# Altium project neuro_module.PrjPcb
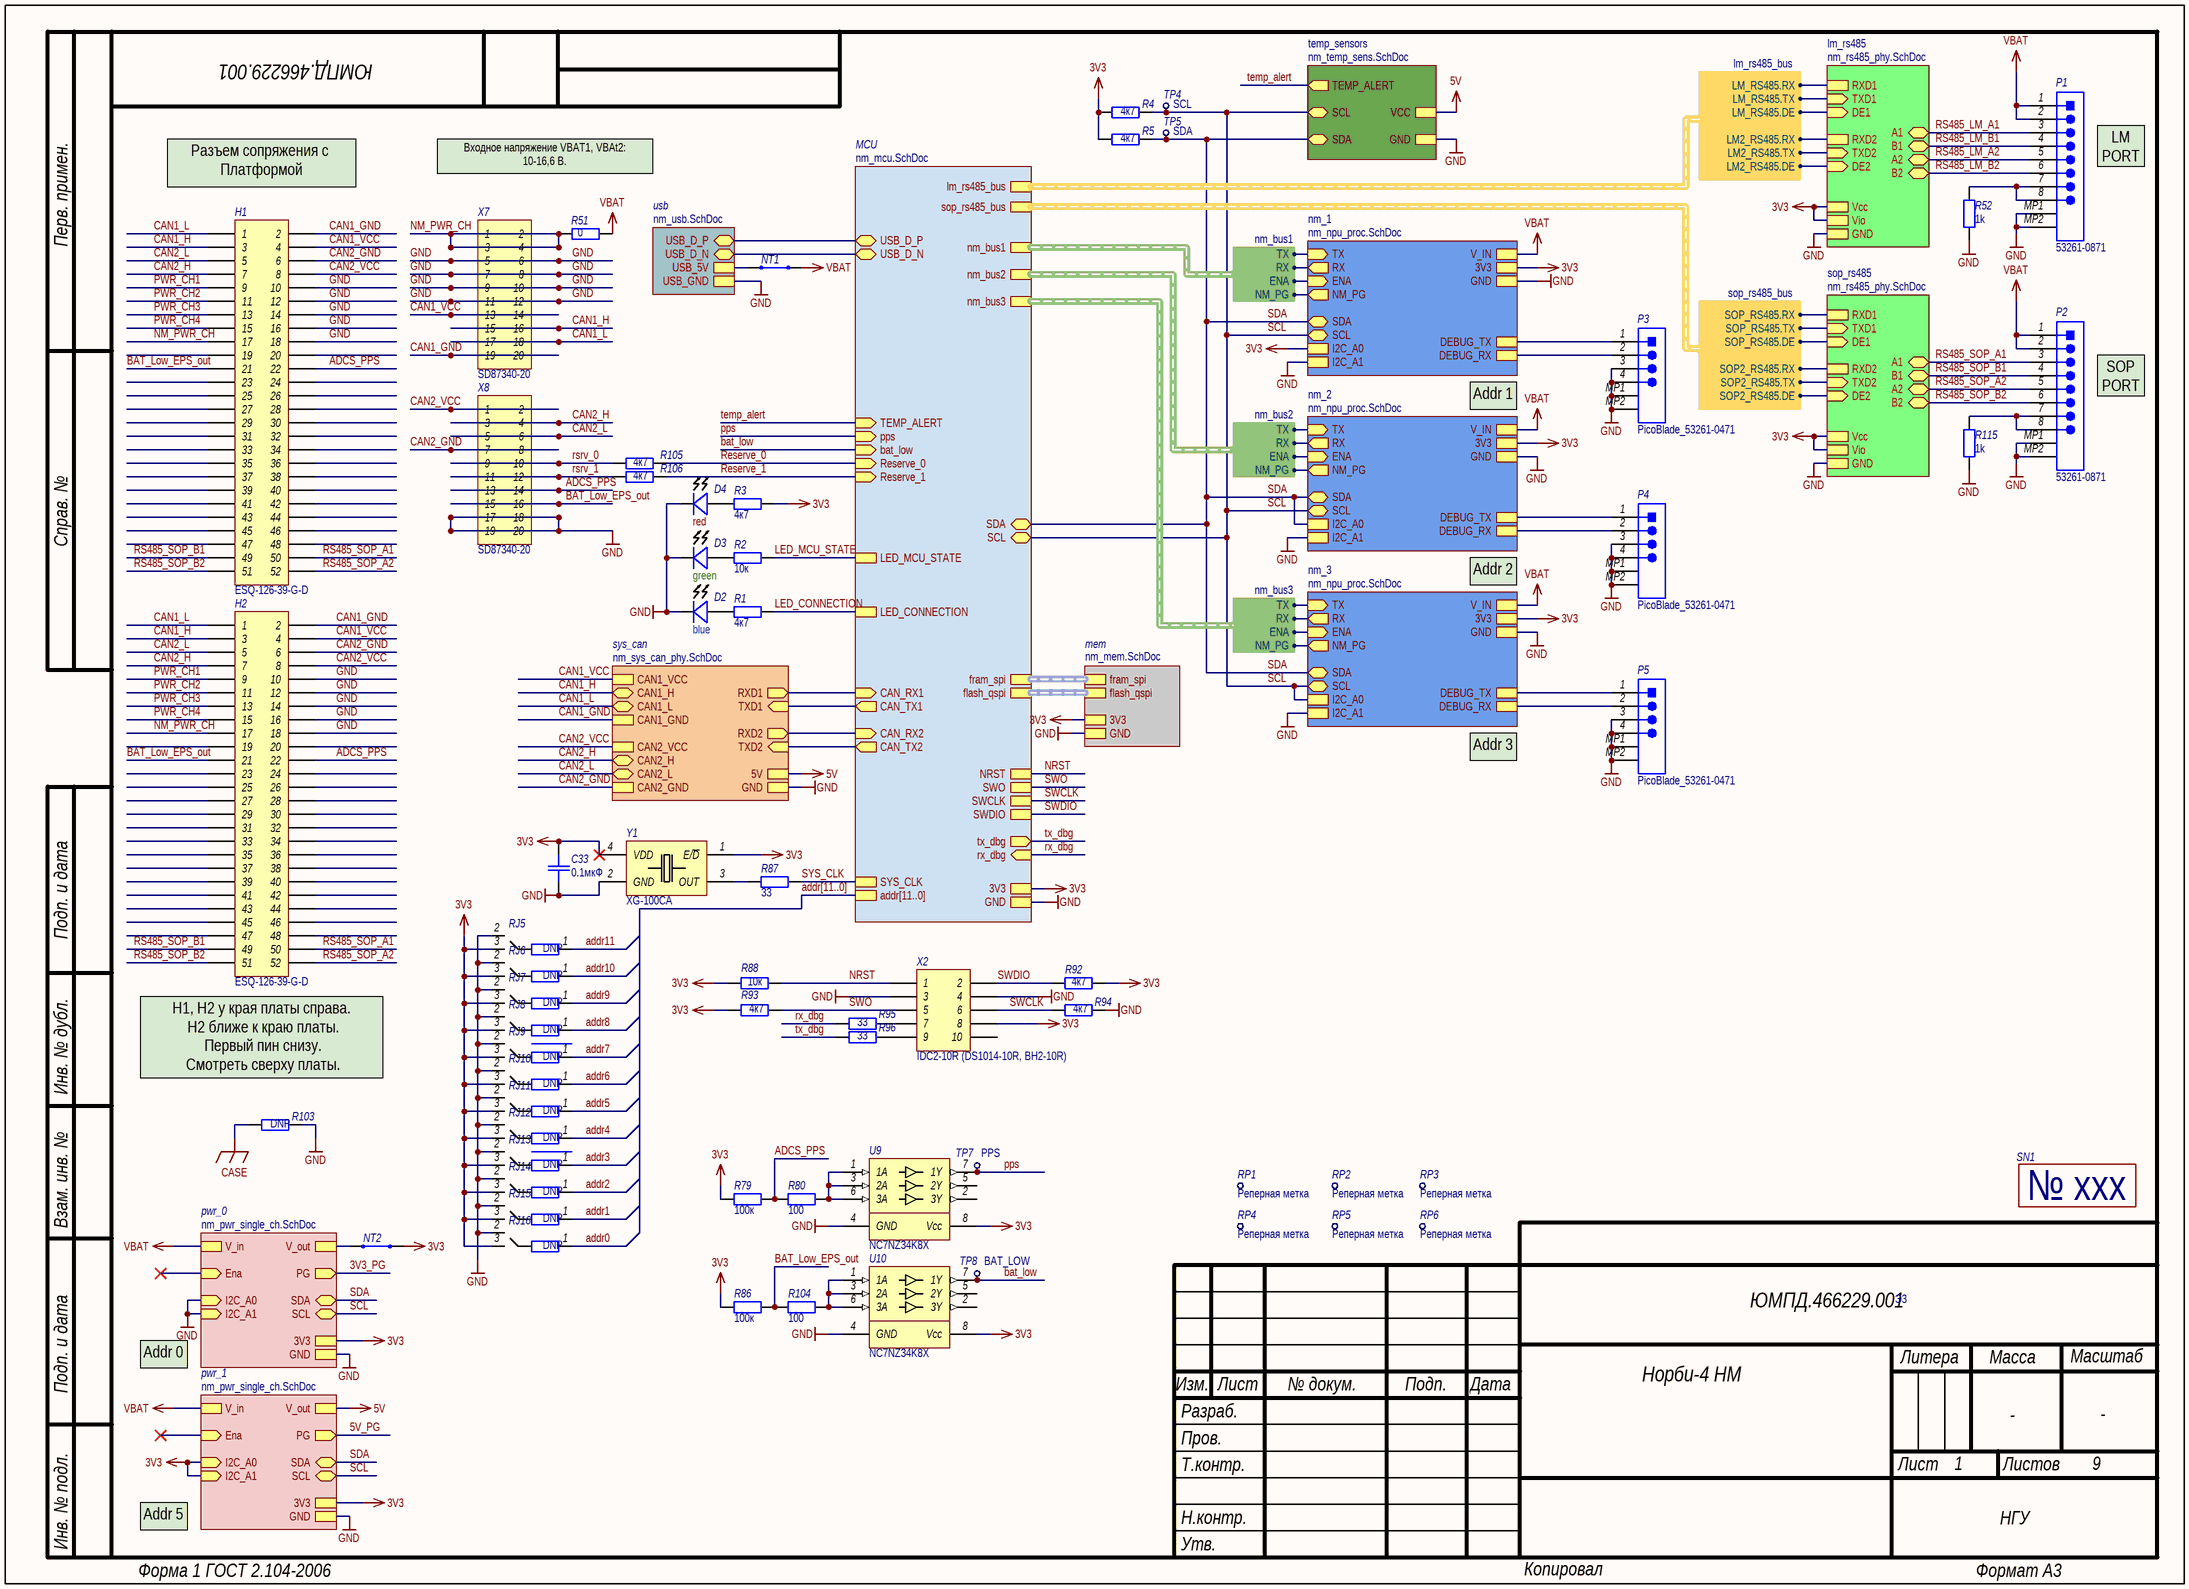
[diagram p0: nm_main.SchDoc]
GlobalOrganizationName: НГУ; GlobalProjectName1: Норби-4 НМ; GlobalProjectNumber: ЮМПД.466229.001; GlobalProjectRevision: v1.0
5 sheets, 141 parts. Net scope: hierarchical (ports join the sheet entries above them; power ports are global).
Board file: neuro_module.PcbDoc
Sheets:
  nm_main.SchDoc
    MCU = nm_mcu.SchDoc
    mem = nm_mem.SchDoc
    nm_3 = nm_npu_proc.SchDoc
    nm_2 = nm_npu_proc.SchDoc
    nm_1 = nm_npu_proc.SchDoc
    temp_sensors = nm_temp_sens.SchDoc

## Sheet nm_main.SchDoc: =GlobalProjectName
size 410 x 297 mm; Organization: НГУ; DocumentNumber: ЮМПД.466229.001 Э3; Revision: v1.0; SheetNumber: 1; SheetTotal: 9; PageSetup: Record=PageOptions|CenterHorizontal=True|CenterVertical=True|PrintScale=1.00|XCorrection=1.00|YCorrection=1.00|PrintKind=1|BorderSize=5000000|LeftOffset=0|BottomOffset=0|Orientation=2|PaperLength=1000|PaperWidth=1000|Scale=100|PaperSource=15|PrintQuality=1200|MediaType=1|DitherType=10|PaperKind=A3|PrintScaleMode=1; Weight: -; ScaleFactor: -; FirstApplication: ЮМПД.466229.001

### Parts
C33  0.1мкФ  [SMD_C0603]
D2  value blue  [LED_0603]  (hidden comment: LED)
D3  value green  [LED_0603]  (hidden comment: LED)
D4  value red  [LED_0603]  (hidden comment: LED)
H1  ESQ-126-39-G-D  [ESQ-126-39-G-D]
H2  ESQ-126-39-G-D  [ESQ-126-39-G-D]
NT1  OSM R1-8  [NetTie_1mm]  (value not drawn)  (net tie, no BOM)
NT2  OSM R1-8  [NetTie_1mm]  (value not drawn)  (net tie, no BOM)
P1  53261-0871  [53261-0871]
P2  53261-0871  [53261-0871]
P3  PicoBlade_53261-0471  [53261-0471]
P4  PicoBlade_53261-0471  [53261-0471]
P5  PicoBlade_53261-0471  [53261-0471]
R1  4к7  [SMD_0603]
R2  10к  [SMD_0603]
R3  4к7  [SMD_0603]
R4  4к7  [SMD_0603]
R5  4к7  [SMD_0603]
R51  0  [SMD_1206]
R52  1k  [SMD_0603]
R79  100к  [SMD_0603]
R80  100  [SMD_0603]
R86  100к  [SMD_0603]
R87  33  [SMD_0603]
R88  value 10к  [SMD_0603]  (hidden comment: Resistor)
R92  4к7  [SMD_0603]
R93  4к7  [SMD_0603]
R94  4к7  [SMD_0603]
R95  33  [SMD_0603]
R96  33  [SMD_0603]
R103  DNP  [SMD_0805]
R104  100  [SMD_0603]
R105  4к7  [SMD_0603]
R106  4к7  [SMD_0603]
R115  1k  [SMD_0603]
RJ5  value DNP  [SMD_JMP_0402]  (hidden comment: OSM R1-8)
RJ6  value DNP  [SMD_JMP_0402]  (hidden comment: OSM R1-8)
RJ7  value DNP  [SMD_JMP_0402]  (hidden comment: OSM R1-8)
RJ8  value DNP  [SMD_JMP_0402]  (hidden comment: OSM R1-8)
RJ9  value DNP  [SMD_JMP_0402]  (hidden comment: OSM R1-8)
RJ10  value DNP  [SMD_JMP_0402]  (hidden comment: OSM R1-8)
RJ11  value DNP  [SMD_JMP_0402]  (hidden comment: OSM R1-8)
RJ12  value DNP  [SMD_JMP_0402]  (hidden comment: OSM R1-8)
RJ13  value DNP  [SMD_JMP_0402]  (hidden comment: OSM R1-8)
RJ14  value DNP  [SMD_JMP_0402]  (hidden comment: OSM R1-8)
RJ15  value DNP  [SMD_JMP_0402]  (hidden comment: OSM R1-8)
RJ16  value DNP  [SMD_JMP_0402]  (hidden comment: OSM R1-8)
RP1  Наименование: Реперная метка  [ReperPoint]  (hidden comment: RP)  (no BOM)
RP2  Наименование: Реперная метка  [ReperPoint]  (hidden comment: RP)  (no BOM)
RP3  Наименование: Реперная метка  [ReperPoint]  (hidden comment: RP)  (no BOM)
RP4  Наименование: Реперная метка  [ReperPoint]  (hidden comment: RP)  (no BOM)
RP5  Наименование: Реперная метка  [ReperPoint]  (hidden comment: RP)  (no BOM)
RP6  Наименование: Реперная метка  [ReperPoint]  (hidden comment: RP)  (no BOM)
SN1  Место под нанесение серийного номера  [Serial_number_v2]  (value not drawn)  (graphical)
TP4  SCL  [TP_PAD_1]  (no BOM)
TP5  SDA  [TP_PAD_1]  (no BOM)
TP7  PPS  [TP_PAD_1]  (no BOM)
TP8  BAT_LOW  [TP_PAD_1]  (no BOM)
U9  Наименование: NC7NZ34K8X  [US-8]  (hidden comment: NC7NZ34)
U10  Наименование: NC7NZ34K8X  [US-8]  (hidden comment: NC7NZ34)
X2  Наименование: IDC2-10R (DS1014-10R, BH2-10R)  [IDC2-10R]  (hidden comment: Header 2X10)
X7  Наименование: SD87340-20  [PLD2-20_SD87340-20]  (hidden comment: Header 2X20)
X8  Наименование: SD87340-20  [PLD2-20_SD87340-20]  (hidden comment: Header 2X20)
Y1  Наименование: XG-100CA  [SMD_7050_Crystal_Oscillator]  (hidden comment: XG-1000CA)

### Sub-sheets
lm_rs485 = nm_rs485_phy.SchDoc (file not in this document): A1 (bidir), RXD1, TXD1 (in), DE1 (in), B1 (bidir), A2 (bidir), RXD2, TXD2 (in), DE2 (in), B2 (bidir), Vcc, Vio, GND
MCU = nm_mcu.SchDoc: SDA (bidir), SCL (bidir), USB_D_P (bidir), USB_D_N (bidir), LED_MCU_STATE, LED_CONNECTION, bat_low (in), CAN_TX2 (out), CAN_RX2 (in), CAN_TX1 (out), CAN_RX1 (in), SYS_CLK, NRST, tx_dbg (out), SWO, rx_dbg (in), SWCLK, GND, SWDIO, 3V3, fram_spi, flash_qspi, Reserve_0 (in), Reserve_1 (in), addr[11..0], nm_bus1 (harness nm_bus1), nm_bus2 (harness nm_bus2), nm_bus3 (harness nm_bus3), lm_rs485_bus (harness lm_rs485_bus), sop_rs485_bus (harness sop_rs485_bus), pps (in), TEMP_ALERT (in)
mem = nm_mem.SchDoc: 3V3, GND, fram_spi (harness fram_spi), flash_qspi (harness flash_qspi)
nm_1 = nm_npu_proc.SchDoc: GND, V_IN, TX (in), RX (out), 3V3, ENA (in), I2C_A0, I2C_A1, SCL (bidir), SDA (bidir), NM_PG (out), DEBUG_TX, DEBUG_RX
nm_2 = nm_npu_proc.SchDoc: GND, V_IN, TX (in), RX (out), 3V3, ENA (in), I2C_A0, I2C_A1, SCL (bidir), SDA (bidir), NM_PG (out), DEBUG_TX, DEBUG_RX
nm_3 = nm_npu_proc.SchDoc: GND, V_IN, TX (in), RX (out), DEBUG_TX, DEBUG_RX, 3V3, ENA (in), I2C_A0, I2C_A1, SCL (bidir), SDA (bidir), NM_PG (out)
pwr_0 = nm_pwr_single_ch.SchDoc (file not in this document): Ena (in), V_in, PG (out), GND, V_out, SCL (bidir), SDA (bidir), I2C_A0 (in), I2C_A1 (in), 3V3  | TP_STR: 3V3; R1_Value: 150к; R2_Value: 47к; R_efuse1_mid: 120к; R_efuse1_bot: 43к; R_efuse1_ilim: 3к3; R_pwr_led: 4к7; R_efuse2_bot: 270к; R_efuse1_top: 470к; R_efuse2_mid: 91к; R_efuse2_ilim: 1к1; R_efuse2_top: 470к; C_efuse2_dVdT: 10нФ; C_efuse2_itimer: 2.4нФ
pwr_1 = nm_pwr_single_ch.SchDoc (file not in this document): Ena (in), V_in, PG (out), GND, V_out, SCL (bidir), SDA (bidir), I2C_A0 (in), I2C_A1 (in), 3V3  | TP_STR: 5V0; R1_Value: 160к; R2_Value: 30к; R_efuse1_mid: 120к; R_efuse1_bot: 43к; R_efuse1_ilim: 3к3; R_pwr_led: 4к7; R_efuse2_bot: 130к; R_efuse2_mid: 62к; R_efuse2_ilim: 3к3; R_efuse1_top: 470к; R_efuse2_top: 470к; C_efuse2_dVdT: 10нФ; C_efuse2_itimer: 2.4нФ
sop_rs485 = nm_rs485_phy.SchDoc (file not in this document): A1 (bidir), RXD1, TXD1 (in), DE1 (in), B1 (bidir), A2 (bidir), RXD2, TXD2 (in), DE2 (in), B2 (bidir), Vcc, Vio, GND
sys_can = nm_sys_can_phy.SchDoc (file not in this document): CAN1_GND, CAN2_H (bidir), CAN2_L (bidir), TXD2 (in), CAN2_GND, CAN1_H (bidir), RXD2 (out), TXD1 (in), CAN2_VCC, CAN1_L (bidir), RXD1 (out), CAN1_VCC, 5V, GND
temp_sensors = nm_temp_sens.SchDoc: VCC, GND, SDA (bidir), SCL (bidir), TEMP_ALERT (out)
usb = nm_usb.SchDoc (file not in this document): USB_D_P (bidir), USB_D_N (bidir), USB_5V, USB_GND

### Harnesses
nm_bus1: TX, RX, ENA, NM_PG
nm_bus2: TX, RX, ENA, NM_PG
nm_bus3: TX, RX, ENA, NM_PG
lm_rs485_bus: LM_RS485.RX, LM_RS485.TX, LM_RS485.DE, LM2_RS485.RX, LM2_RS485.TX, LM2_RS485.DE
sop_rs485_bus: SOP_RS485.RX, SOP_RS485.TX, SOP_RS485.DE, SOP2_RS485.RX, SOP2_RS485.TX, SOP2_RS485.DE

### Nets
3V3: C33.2 NT2.2 R3.1 R4.2 R5.2 R79.1 R86.1 R88.1 R92.2 R93.2 RJ5.3 RJ6.3 RJ7.3 RJ8.3 RJ9.3 RJ10.3 RJ11.3 RJ12.3 RJ13.3 RJ14.3 RJ15.3 RJ16.3 U9.8(Vcc) U10.8(Vcc) X2.8 Y1.1(E/~{D}) Y1.4(VDD) ; sheet MCU/3V3, sheet pwr_0/3V3, sheet mem/3V3, sheet pwr_1/I2C_A0, sheet pwr_1/I2C_A1, sheet pwr_1/3V3, sheet nm_3/3V3, sheet lm_rs485/Vcc, sheet lm_rs485/Vio, sheet nm_2/3V3, sheet nm_1/3V3, sheet nm_1/I2C_A0, sheet sop_rs485/Vcc, sheet sop_rs485/Vio
5V: sheet sys_can/5V, sheet pwr_1/V_out, sheet temp_sensors/VCC
CASE: R103.2
GND: C33.1 D2.2(K) D3.2(K) D4.2(K) H1.10 H1.12 H1.14 H1.16 H1.18 H2.10 H2.12 H2.14 H2.16 H2.18 P1.MP1 P1.MP2 P2.MP1 P2.MP2 P3.3 P3.4 P3.MP1 P3.MP2 P4.3 P4.4 P4.MP1 P4.MP2 P5.3 P5.4 P5.MP1 P5.MP2 R52.1 R94.1 R103.1 R115.1 RJ5.2 RJ6.2 RJ7.2 RJ8.2 RJ9.2 RJ10.2 RJ11.2 RJ12.2 RJ13.2 RJ14.2 RJ15.2 RJ16.2 U9.4(GND) U10.4(GND) X2.3 X2.4 X7.5 X7.6 X7.7 X7.8 X7.9 X7.10 X7.11 X7.12 X8.17 X8.18 X8.19 X8.20 Y1.2(GND) ; sheet MCU/GND, sheet usb/USB_GND, sheet pwr_0/GND, sheet pwr_0/I2C_A0, sheet pwr_0/I2C_A1, sheet mem/GND, sheet sys_can/GND, sheet pwr_1/GND, sheet nm_3/GND, sheet nm_3/I2C_A1, sheet lm_rs485/GND, sheet nm_2/GND, sheet nm_2/I2C_A1, sheet nm_1/GND, sheet nm_1/I2C_A1, sheet sop_rs485/GND, sheet temp_sensors/GND
VBAT: NT1.2 P1.1 P1.2 P2.1 P2.2 R51.2 ; sheet pwr_0/V_in, sheet pwr_1/V_in, sheet nm_3/V_IN, sheet nm_2/V_IN, sheet nm_1/V_IN
3V3_PG: sheet pwr_0/PG
5V_PG: sheet pwr_1/PG
ADCS_PPS: H1.22 H2.22 R79.2 R80.1 X8.13 X8.14
addr0: RJ16.1
addr1: RJ15.1
addr2: RJ14.1
addr3: RJ13.1
addr4: RJ12.1
addr5: RJ11.1
addr6: RJ10.1
addr7: RJ9.1
addr8: RJ8.1
addr9: RJ7.1
addr10: RJ6.1
addr11: RJ5.1
bat_low: TP8.0(TP) U10.7(1Y) ; sheet MCU/bat_low
BAT_Low_EPS_out: H1.21 H2.21 R86.2 R104.1 X8.15 X8.16
CAN1_GND: H1.2 H2.2 X7.19 X7.20 ; sheet sys_can/CAN1_GND
CAN1_H: H1.3 H2.3 X7.15 X7.16 ; sheet sys_can/CAN1_H
CAN1_L: H1.1 H2.1 X7.17 X7.18 ; sheet sys_can/CAN1_L
CAN1_VCC: H1.4 H2.4 X7.13 X7.14 ; sheet sys_can/CAN1_VCC
CAN2_GND: H1.6 H2.6 X8.7 X8.8 ; sheet sys_can/CAN2_GND
CAN2_H: H1.7 H2.7 X8.3 X8.4 ; sheet sys_can/CAN2_H
CAN2_L: H1.5 H2.5 X8.5 X8.6 ; sheet sys_can/CAN2_L
CAN2_VCC: H1.8 H2.8 X8.1 X8.2 ; sheet sys_can/CAN2_VCC
CAN_RX1: sheet MCU/CAN_RX1, sheet sys_can/RXD1
CAN_RX2: sheet MCU/CAN_RX2, sheet sys_can/RXD2
CAN_TX1: sheet MCU/CAN_TX1, sheet sys_can/TXD1
CAN_TX2: sheet MCU/CAN_TX2, sheet sys_can/TXD2
DEBUG_RX: P3.2 ; sheet nm_1/DEBUG_RX
DEBUG_RX: P4.2 ; sheet nm_2/DEBUG_RX  [a separate net that carries the same name]
DEBUG_RX: P5.2 ; sheet nm_3/DEBUG_RX  [a separate net that carries the same name]
DEBUG_TX: P3.1 ; sheet nm_1/DEBUG_TX
DEBUG_TX: P4.1 ; sheet nm_2/DEBUG_TX  [a separate net that carries the same name]
DEBUG_TX: P5.1 ; sheet nm_3/DEBUG_TX  [a separate net that carries the same name]
LED_CONNECTION: R1.1 ; sheet MCU/LED_CONNECTION
LED_MCU_STATE: R2.1 ; sheet MCU/LED_MCU_STATE
lm2_rs485.DE: sheet lm_rs485/DE2, sheet MCU/lm_rs485_bus.LM2_RS485.DE
lm2_rs485.RX: sheet lm_rs485/RXD2, sheet MCU/lm_rs485_bus.LM2_RS485.RX
lm2_rs485.TX: sheet lm_rs485/TXD2, sheet MCU/lm_rs485_bus.LM2_RS485.TX
lm_rs485.DE: sheet lm_rs485/DE1, sheet MCU/lm_rs485_bus.LM_RS485.DE
lm_rs485.RX: sheet lm_rs485/RXD1, sheet MCU/lm_rs485_bus.LM_RS485.RX
lm_rs485.TX: sheet lm_rs485/TXD1, sheet MCU/lm_rs485_bus.LM_RS485.TX
nm_bus1.Ena: sheet nm_1/ENA, sheet MCU/nm_bus1.ENA
nm_bus1.RX: sheet nm_1/RX, sheet MCU/nm_bus1.RX
nm_bus1.TX: sheet nm_1/TX, sheet MCU/nm_bus1.TX
nm_bus2.Ena: sheet nm_2/ENA, sheet MCU/nm_bus2.ENA
nm_bus2.RX: sheet nm_2/RX, sheet MCU/nm_bus2.RX
nm_bus2.TX: sheet nm_2/TX, sheet MCU/nm_bus2.TX
nm_bus3.Ena: sheet nm_3/ENA, sheet MCU/nm_bus3.ENA
nm_bus3.RX: sheet nm_3/RX, sheet MCU/nm_bus3.RX
nm_bus3.TX: sheet nm_3/TX, sheet MCU/nm_bus3.TX
NM_PWR_CH: H1.17 H2.17 R51.1 X7.1 X7.2 X7.3 X7.4
NRST: R88.2 X2.1 ; sheet MCU/NRST
PG: sheet nm_3/NM_PG, sheet nm_2/NM_PG, sheet nm_1/NM_PG, sheet MCU/nm_bus1.NM_PG, sheet MCU/nm_bus2.NM_PG, sheet MCU/nm_bus3.NM_PG
pps: TP7.0(TP) U9.7(1Y) ; sheet MCU/pps
PWR_CH1: H1.9 H2.9
PWR_CH2: H1.11 H2.11
PWR_CH3: H1.13 H2.13
PWR_CH4: H1.15 H2.15
Reserve_0: R105.1 ; sheet MCU/Reserve_0
Reserve_1: R106.1 ; sheet MCU/Reserve_1
RS485_LM_A1: P1.3 ; sheet lm_rs485/A1
RS485_LM_A2: P1.5 ; sheet lm_rs485/A2
RS485_LM_B1: P1.4 ; sheet lm_rs485/B1
RS485_LM_B2: P1.6 ; sheet lm_rs485/B2
RS485_SOP_A1: H1.50 H2.50 P2.3 ; sheet sop_rs485/A1
RS485_SOP_A2: H1.52 H2.52 P2.5 ; sheet sop_rs485/A2
RS485_SOP_B1: H1.49 H2.49 P2.4 ; sheet sop_rs485/B1
RS485_SOP_B2: H1.51 H2.51 P2.6 ; sheet sop_rs485/B2
rsrv_0: R105.2 X8.9 X8.10
rsrv_1: R106.2 X8.11 X8.12
rx_dbg: R95.1 ; sheet MCU/rx_dbg
SCL: R4.1 TP4.0(TP) ; sheet MCU/SCL, sheet pwr_0/SCL, sheet pwr_1/SCL, sheet nm_3/I2C_A0, sheet nm_3/SCL, sheet nm_2/SCL, sheet nm_1/SCL, sheet temp_sensors/SCL
SDA: R5.1 TP5.0(TP) ; sheet MCU/SDA, sheet pwr_0/SDA, sheet pwr_1/SDA, sheet nm_3/SDA, sheet nm_2/I2C_A0, sheet nm_2/SDA, sheet nm_1/SDA, sheet temp_sensors/SDA
sop2_rs485.DE: sheet sop_rs485/DE2, sheet MCU/sop_rs485_bus.SOP2_RS485.DE
sop2_rs485.RX: sheet sop_rs485/RXD2, sheet MCU/sop_rs485_bus.SOP2_RS485.RX
sop2_rs485.TX: sheet sop_rs485/TXD2, sheet MCU/sop_rs485_bus.SOP2_RS485.TX
sop_rs485.DE: sheet sop_rs485/DE1, sheet MCU/sop_rs485_bus.SOP_RS485.DE
sop_rs485.RX: sheet sop_rs485/RXD1, sheet MCU/sop_rs485_bus.SOP_RS485.RX
sop_rs485.TX: sheet sop_rs485/TXD1, sheet MCU/sop_rs485_bus.SOP_RS485.TX
SWCLK: R94.2 X2.6 ; sheet MCU/SWCLK
SWDIO: R92.1 X2.2 ; sheet MCU/SWDIO
SWO: R93.1 X2.5 ; sheet MCU/SWO
SYS_CLK: R87.2 ; sheet MCU/SYS_CLK
temp_alert: sheet MCU/TEMP_ALERT, sheet temp_sensors/TEMP_ALERT
tx_dbg: R96.1 ; sheet MCU/tx_dbg
USB_D_N: sheet MCU/USB_D_N, sheet usb/USB_D_N
USB_D_P: sheet MCU/USB_D_P, sheet usb/USB_D_P
NetD2_1: D2.1(A) R1.2
NetD3_1: D3.1(A) R2.2
NetD4_1: D4.1(A) R3.2
NetNT1_1: NT1.1 ; sheet usb/USB_5V
NetNT2_1: NT2.1 ; sheet pwr_0/V_out
NetP1_7: P1.7 P1.8 R52.2
NetP2_7: P2.7 P2.8 R115.2
NetR80_2: R80.2 U9.1(1A) U9.3(2A) U9.6(3A)
NetR87_1: R87.1 Y1.3(OUT)
NetR95_2: R95.2 X2.7
NetR96_2: R96.2 X2.9
NetR104_2: R104.2 U10.1(1A) U10.3(2A) U10.6(3A)

Not connected (* = marked no-connect by the designer): H1 19 20 23 24 25 26 27 28 29 30 31 32 33 34 35 36 37 38 39 40 41 42 43 44 45 46 47 48; H2 19 20 23 24 25 26 27 28 29 30 31 32 33 34 35 36 37 38 39 40 41 42 43 44 45 46 47 48; U9 2(3Y) 5(2Y); U10 2(3Y) 5(2Y); X2 10

### Buses and harness runs
bus addr[11..0] = sheet MCU/addr[11..0]
harness sheet MCU/flash_qspi = sheet mem/flash_qspi
harness sheet MCU/fram_spi = sheet mem/fram_spi

### Notes on the sheet
- (near H1) Разъем сопряжения с
  Платформой
- Входное напряжение VBAT1, VBAt2:
  10-16,6 В.
- (near P1) LM PORT
- (near P2) SOP
  PORT
- Addr 1
- Addr 2
- Addr 3
- H1, H2 у края платы справа.
  H2 ближе к краю платы.
  Первый пин снизу.
  Смотреть сверху платы.
- Addr 0
- Addr 5
- Перв. примен.
- Справ. №
- Подп. и дата
- Инв. № дубл.
- Взам. инв. №
- Э3
- Изм.
- Разраб.
- Лист
- № докум.
- Подп.
- Дата
- Литера
- Масса
- Масштаб
- Пров.
- Т.контр.
- Листов
- Н.контр.
- Утв.
- Инв. № подл.
- Форма 1 ГОСТ 2.104-2006
- Копировал
- Формат А3
- (in symbol Serial_number) № xxx

### Library data of the parts
C33 = Capacitor: Назначение: SMD-конденсатор; Наименование: Конденсатор; Потребление, Вт: 0; Точность: %; Напряжение: В; Value: 0.1мкФ; Диэлектрик: *; Place_v1: *; Place_v2: *
D2-D4 = LED: Назначение: Светодиод; Наименование: SMD-LED; Потребление, Вт: 0,01; Place_v1: *; Place_v2: *
H1 H2 = ESQ-126-39-G-D: Elevated socket, dual-row, 26-pin per row; Назначение: Сквозной разъем, двойно, 52 контакта, шаг 2,54 мм; Потребление, Вт: 0,00; Place_v2: DNP; ComponentLink1Description: DataSheet; ComponentLink1URL: https://static.chipdip.ru/lib/071/DOC025071643.pdf; Наименование: ESQ-126-39-G-D
NT1 NT2 = NetTie: Different Nets connection; Потребление, Вт: 0,001; Value: 0; Наименование: NetTie; Назначение: NetTie; Place_v1: *; Place_v2: *
P1 P2 = PicoBlade_53261-0871: Male Header, Pitch 1.25 mm, 1 x 8 Position, Height 3.4 mm, -40 to 85 degC, RoHS, Tape and Reel; Потребление, Вт: 0.0; Назначение: Male Header, Pitch 1.25 mm, 1 x 8 Position, Height 3.4 mm, -40 to 85 degC, RoHS, Tape and Reel; ComponentLink1Description: DataSheet; ComponentLink1URL: http://www.molex.com/pdm_docs/sd/532610671_sd.pdf; Наименование: 53261-0871
P3-P5 = PicoBlade_53261-0471: Male Header, Pitch 1.25 mm, 1 x 4 Position, Height 3.4 mm, -40 to 85 degC, RoHS, Tape and Reel; Потребление, Вт: 0.0; Наименование: PicoBlade_53261-0471; Назначение: Male Header, Pitch 1.25 mm, 1 x 4 Position, Height 3.4 mm, -40 to 85 degC, RoHS, Tape and Reel; ComponentLink1Description: DataSheet; ComponentLink1URL: http://www.molex.com/pdm_docs/sd/532610471_sd.pdf
R1-R3 R87 R95 R96 R105 R106 = Resistor: Наименование: Резистор; Назначение: SMD-резистор; Потребление, Вт: 0,001
  R1 R3: Value: 4к7; Place_v1: *; Place_v2: *
  R2: Value: 10к; Place_v1: *; Place_v2: *
  R87 R95 R96: Value: 33; Place_v1: *; Place_v2: *
  R105 R106: Value: 4к7
R4 R5 R52 R79 R86 R92-R94 R103 R115 = Resistor: Наименование: Резистор; Назначение: SMD-резистор; Потребление, Вт: 0,001; Описание: Резистор 0603 10K ±1% 100ppm/°C; Place_v1: *; Place_v2: *
  R4 R5 R92-R94: Value: 4к7
  R52 R115: Value: 1k
  R79 R86: Value: 100к
  R103: Value: DNP
R51 = Resistor: Наименование: Резистор; Назначение: SMD-резистор; Потребление, Вт: 0,001; Place_v2: DNP; Value: 0
R80 R104 = Resistor: Наименование: Резистор; Назначение: SMD-резистор; Потребление, Вт: 0,001; Описание: Резистор 0603 100 ±1% 100ppm/°C; Value: 100; Place_v1: *; Place_v2: *
R88 = Resistor: Наименование: Резистор; Назначение: SMD-резистор; Потребление, Вт: 0,001; Точность: %; Place_v1: *; Place_v2: *
RJ5-RJ16 = Resistor_Jamper: Resistor-Jumper; Назначение: Резистор для выбора режима; Наименование: Резистор; Потребление, Вт: 0,0; Place_v1: *; Place_v2: *
RP1-RP6 = RP: Назначение: реперная метка для автоматического монтажа; Place_v1: *; Place_v2: *
SN1 = Serial_number: Потребление, Вт: 0; Назначение: Место под нанесение серийного номера; Наименование: Место под нанесение серийного номера; Place_v1: *; Place_v2: *
TP4 TP5 TP7 TP8 = TP: Наименование: Точка проверки; Назначение: Контроль параметров платы; Place_v1: *; Place_v2: *
  TP4: TP_Name: SCL
  TP5: TP_Name: SDA
  TP7: TP_Name: PPS
  TP8: TP_Name: BAT_LOW
U9 U10 = NC7NZ34: TinyLogic UHS Triple Buffer; Потребление, Вт: 0.01; Назначение: TinyLogic UHS Triple Buffer; ComponentLink1Description: DataSheet; ComponentLink1URL: https://www.onsemi.com/pdf/datasheet/nc7nz34-d.pdf; Supplier 1: Digi-Key; Supplier Part Number 1: NC7NZ34K8XCT-ND; Place_v1: *; Place_v2: *
X2 = Header 2X10: Header, 10-Pin, Dual row; Назначение: Header, 10-Pin, Dual row, R/A; Потребление, Вт: 0,0
X7 X8 = Header 2X20: Header, 20-Pin, Dual row; Потребление, Вт: 0,0; Place_v2: DNP; Примечание: Для монтажа из 2-х 10-pin необходимо сточить край разъема; Назначение: Header, 20-Pin, Dual row
Y1 = Crystal_Oscillator: Crystall oscillator, CMOS, 3.3V, SMD7050; Назначение: Crystall oscillator, CMOS, 3.3V, SMD7050, 10 МГц; Потребление, Вт: 0.12; ComponentLink1Description: DataSheet; ComponentLink1URL: https://ru.mouser.com/datasheet/2/137/G_1000CA_en-1003255.pdf; Place_v1: *; Place_v2: *

## Sheet nm_mcu.SchDoc: =GlobalProjectName
size 410 x 297 mm; Organization: НГУ; DocumentNumber: ЮМПД.466229.001 Э3; Revision: v1.0; SheetNumber: 2; SheetTotal: 9; PageSetup: Record=PageOptions|CenterHorizontal=True|CenterVertical=True|PrintScale=1.00|XCorrection=1.00|YCorrection=1.00|PrintKind=1|BorderSize=5000000|LeftOffset=0|BottomOffset=0|Orientation=2|PaperLength=1000|PaperWidth=1000|Scale=100|PaperSource=15|PrintQuality=1200|MediaType=1|DitherType=10|PaperKind=A3|PrintScaleMode=1; Weight: -; ScaleFactor: -; FirstApplication: ЮМПД.466229.001
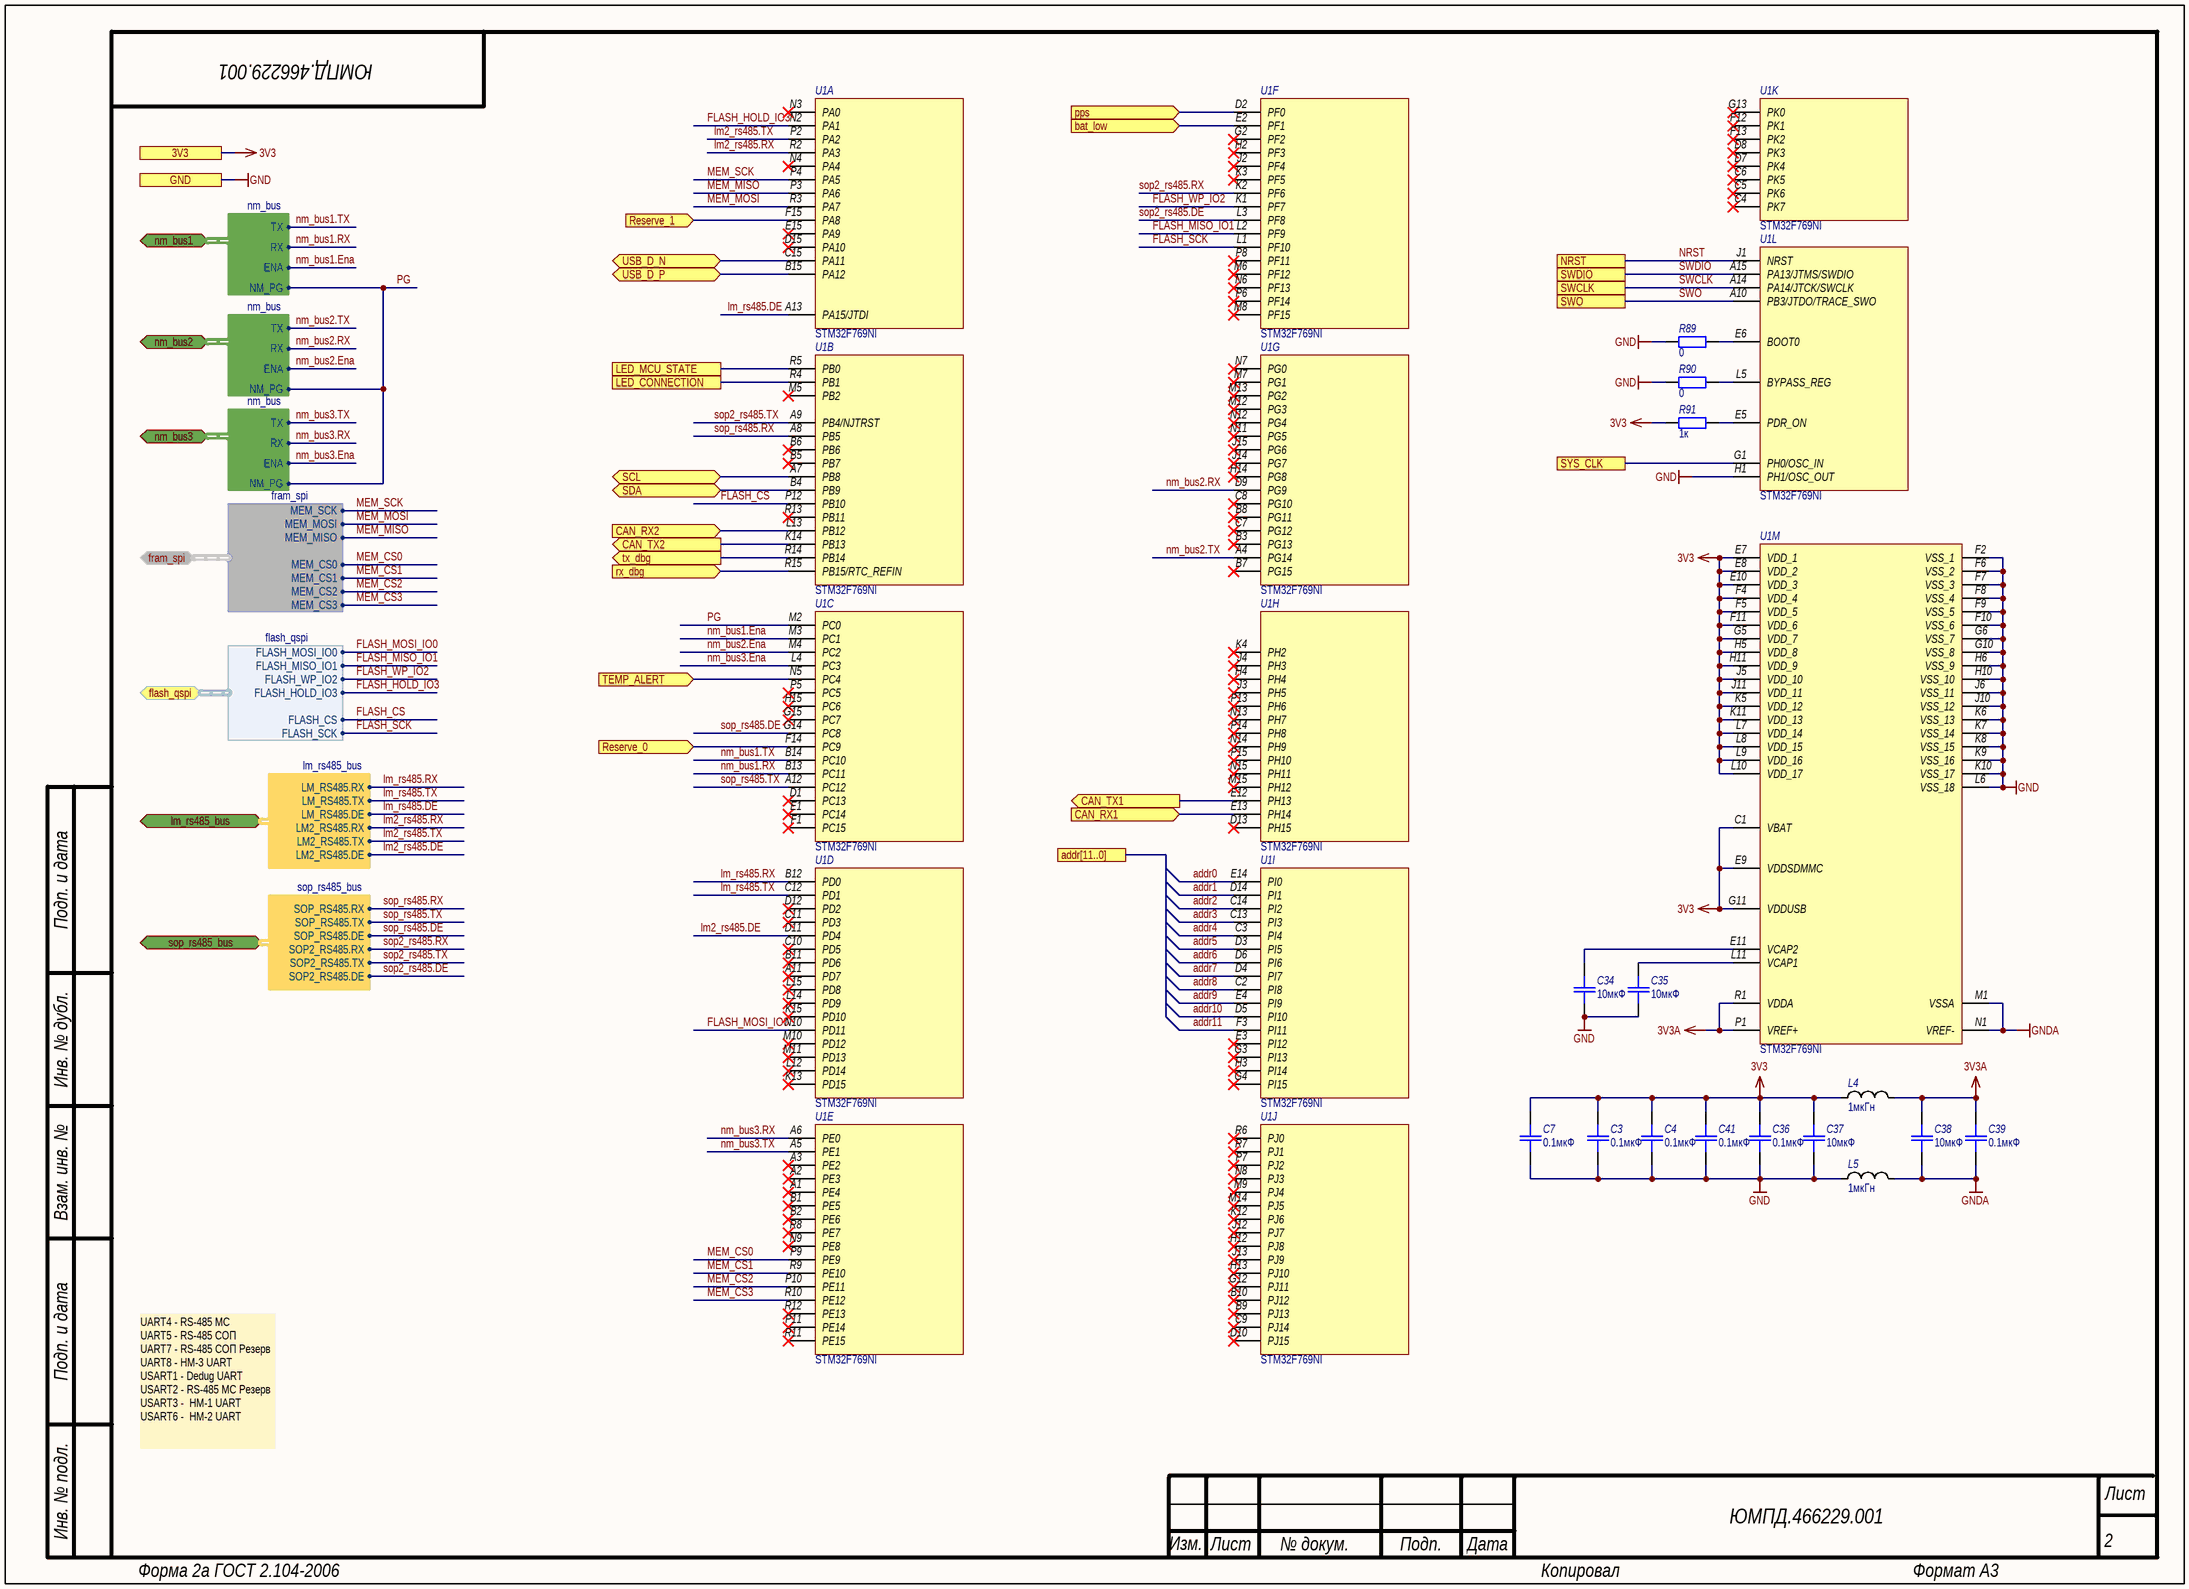
[diagram p1: nm_mcu.SchDoc]

### Parts
C3  0.1мкФ  [SMD_C0603]
C4  0.1мкФ  [SMD_C0603]
C7  0.1мкФ  [SMD_C0603]
C34  value 10мкФ  [SMD_C0603]  (hidden comment: Capacitor)
C35  value 10мкФ  [SMD_C0603]  (hidden comment: Capacitor)
C36  0.1мкФ  [SMD_C0603]
C37  10мкФ  [SMD_C0603]
C38  10мкФ  [SMD_C0603]
C39  0.1мкФ  [SMD_C0603]
C41  0.1мкФ  [SMD_C0603]
L4  1мкГн  [SMD_0805]
L5  1мкГн  [SMD_0805]
R89  value 0  [SMD_0603]  (hidden comment: Resistor)
R90  value 0  [SMD_0603]  (hidden comment: Resistor)
R91  value 1к  [SMD_0603]  (hidden comment: Resistor)
U1  STM32F769NI  [BGA216C80P15X15_1300X1300X110]  (parts A,B,C,D,E,F,G,H,I,J,K,L,M of 13)

### Ports
3V3, addr[11..0], bat_low (in), CAN_RX1 (in), CAN_RX2 (in), CAN_TX1 (out), CAN_TX2 (out), flash_qspi (bidir, harness flash_qspi), fram_spi (bidir, harness fram_spi), GND, LED_CONNECTION, LED_MCU_STATE, lm_rs485_bus (bidir, harness lm_rs485_bus), nm_bus1 (bidir, harness nm_bus), nm_bus2 (bidir, harness nm_bus), nm_bus3 (bidir, harness nm_bus), NRST, pps (in), Reserve_0 (in), Reserve_1 (in), rx_dbg (in), SCL (bidir), SDA (bidir), sop_rs485_bus (bidir, harness sop_rs485_bus), SWCLK, SWDIO, SWO, SYS_CLK, TEMP_ALERT (in), tx_dbg (out), USB_D_N (bidir), USB_D_P (bidir)

### Harnesses
fram_spi: MEM_SCK, MEM_MOSI, MEM_MISO, MEM_CS0, MEM_CS1, MEM_CS2, MEM_CS3
flash_qspi: FLASH_MOSI_IO0, FLASH_MISO_IO1, FLASH_WP_IO2, FLASH_HOLD_IO3, FLASH_CS, FLASH_SCK
nm_bus: TX, RX, ENA, NM_PG
lm_rs485_bus: LM_RS485.RX, LM_RS485.TX, LM_RS485.DE, LM2_RS485.RX, LM2_RS485.TX, LM2_RS485.DE
sop_rs485_bus: SOP_RS485.RX, SOP_RS485.TX, SOP_RS485.DE, SOP2_RS485.RX, SOP2_RS485.TX, SOP2_RS485.DE

### Nets
3V3: C3.2 C4.2 C7.2 C36.2 C37.2 C41.2 L4.1 R91.1 U1.C1(VBAT) U1.E7(VDD_1) U1.E8(VDD_2) U1.E9(VDDSDMMC) U1.E10(VDD_3) U1.F4(VDD_4) U1.F5(VDD_5) U1.F11(VDD_6) U1.G5(VDD_7) U1.G11(VDDUSB) U1.H5(VDD_8) U1.H11(VDD_9) U1.J5(VDD_10) U1.J11(VDD_11) U1.K5(VDD_12) U1.K11(VDD_13) U1.L7(VDD_14) U1.L8(VDD_15) U1.L9(VDD_16) U1.L10(VDD_17) ; port 3V3
3V3A: C38.2 C39.2 L4.2 U1.P1(VREF+) U1.R1(VDDA)
GND: C3.1 C4.1 C7.1 C34.1 C35.1 C36.1 C37.1 C41.1 L5.1 R89.1 R90.1 U1.F2(VSS_1) U1.F6(VSS_2) U1.F7(VSS_3) U1.F8(VSS_4) U1.F9(VSS_5) U1.F10(VSS_6) U1.G6(VSS_7) U1.G10(VSS_8) U1.H1(PH1/OSC_OUT) U1.H6(VSS_9) U1.H10(VSS_10) U1.J6(VSS_11) U1.J10(VSS_12) U1.K6(VSS_13) U1.K7(VSS_14) U1.K8(VSS_15) U1.K9(VSS_16) U1.K10(VSS_17) U1.L6(VSS_18) ; port GND
GNDA: C38.1 C39.1 L5.2 U1.M1(VSSA) U1.N1(VREF-)
addr0: U1.E14(PI0)
addr1: U1.D14(PI1)
addr2: U1.C14(PI2)
addr3: U1.C13(PI3)
addr4: U1.C3(PI4)
addr5: U1.D3(PI5)
addr6: U1.D6(PI6)
addr7: U1.D4(PI7)
addr8: U1.C2(PI8)
addr9: U1.E4(PI9)
addr10: U1.D5(PI10)
addr11: U1.F3(PI11)
bat_low: U1.E2(PF1) ; port bat_low
CAN_RX1: U1.E13(PH14) ; port CAN_RX1
CAN_RX2: U1.L13(PB12) ; port CAN_RX2
CAN_TX1: U1.E12(PH13) ; port CAN_TX1
CAN_TX2: U1.K14(PB13) ; port CAN_TX2
FLASH_CS: U1.P12(PB10) ; port flash_qspi.FLASH_CS
FLASH_HOLD_IO3: U1.N2(PA1) ; port flash_qspi.FLASH_HOLD_IO3
FLASH_MISO_IO1: U1.L2(PF9) ; port flash_qspi.FLASH_MISO_IO1
FLASH_MOSI_IO0: U1.N10(PD11) ; port flash_qspi.FLASH_MOSI_IO0
FLASH_SCK: U1.L1(PF10) ; port flash_qspi.FLASH_SCK
FLASH_WP_IO2: U1.K1(PF7) ; port flash_qspi.FLASH_WP_IO2
LED_CONNECTION: U1.R4(PB1) ; port LED_CONNECTION
LED_MCU_STATE: U1.R5(PB0) ; port LED_MCU_STATE
lm2_rs485.DE: U1.D11(PD4) ; port lm_rs485_bus.LM2_RS485.DE
lm2_rs485.RX: U1.R2(PA3) ; port lm_rs485_bus.LM2_RS485.RX
lm2_rs485.TX: U1.P2(PA2) ; port lm_rs485_bus.LM2_RS485.TX
lm_rs485.DE: U1.A13(PA15/JTDI) ; port lm_rs485_bus.LM_RS485.DE
lm_rs485.RX: U1.B12(PD0) ; port lm_rs485_bus.LM_RS485.RX
lm_rs485.TX: U1.C12(PD1) ; port lm_rs485_bus.LM_RS485.TX
MEM_CS0: U1.P9(PE9) ; port fram_spi.MEM_CS0
MEM_CS1: U1.R9(PE10) ; port fram_spi.MEM_CS1
MEM_CS2: U1.P10(PE11) ; port fram_spi.MEM_CS2
MEM_CS3: U1.R10(PE12) ; port fram_spi.MEM_CS3
MEM_MISO: U1.P3(PA6) ; port fram_spi.MEM_MISO
MEM_MOSI: U1.R3(PA7) ; port fram_spi.MEM_MOSI
MEM_SCK: U1.P4(PA5) ; port fram_spi.MEM_SCK
nm_bus1.Ena: U1.M3(PC1) ; port nm_bus1.ENA
nm_bus1.RX: U1.B13(PC11) ; port nm_bus1.RX
nm_bus1.TX: U1.B14(PC10) ; port nm_bus1.TX
nm_bus2.Ena: U1.M4(PC2) ; port nm_bus2.ENA
nm_bus2.RX: U1.D9(PG9) ; port nm_bus2.RX
nm_bus2.TX: U1.A4(PG14) ; port nm_bus2.TX
nm_bus3.Ena: U1.L4(PC3) ; port nm_bus3.ENA
nm_bus3.RX: U1.A6(PE0) ; port nm_bus3.RX
nm_bus3.TX: U1.A5(PE1) ; port nm_bus3.TX
NRST: U1.J1(NRST) ; port NRST
PG: U1.M2(PC0) ; port nm_bus1.NM_PG, port nm_bus2.NM_PG, port nm_bus3.NM_PG
pps: U1.D2(PF0) ; port pps
Reserve_0: U1.F14(PC9) ; port Reserve_0
Reserve_1: U1.F15(PA8) ; port Reserve_1
rx_dbg: U1.R15(PB15/RTC_REFIN) ; port rx_dbg
SCL: U1.A7(PB8) ; port SCL
SDA: U1.B4(PB9) ; port SDA
sop2_rs485.DE: U1.L3(PF8) ; port sop_rs485_bus.SOP2_RS485.DE
sop2_rs485.RX: U1.K2(PF6) ; port sop_rs485_bus.SOP2_RS485.RX
sop2_rs485.TX: U1.A9(PB4/NJTRST) ; port sop_rs485_bus.SOP2_RS485.TX
sop_rs485.DE: U1.G14(PC8) ; port sop_rs485_bus.SOP_RS485.DE
sop_rs485.RX: U1.A8(PB5) ; port sop_rs485_bus.SOP_RS485.RX
sop_rs485.TX: U1.A12(PC12) ; port sop_rs485_bus.SOP_RS485.TX
SWCLK: U1.A14(PA14/JTCK/SWCLK) ; port SWCLK
SWDIO: U1.A15(PA13/JTMS/SWDIO) ; port SWDIO
SWO: U1.A10(PB3/JTDO/TRACE_SWO) ; port SWO
SYS_CLK: U1.G1(PH0/OSC_IN) ; port SYS_CLK
temp_alert: U1.N5(PC4) ; port TEMP_ALERT
tx_dbg: U1.R14(PB14) ; port tx_dbg
USB_D_N: U1.C15(PA11) ; port USB_D_N
USB_D_P: U1.B15(PA12) ; port USB_D_P
NetC34_2: C34.2 U1.E11(VCAP2)
NetC35_2: C35.2 U1.L11(VCAP1)
NetR89_2: R89.2 U1.E6(BOOT0)
NetR90_2: R90.2 U1.L5(BYPASS_REG)
NetR91_2: R91.2 U1.E5(PDR_ON)

Not connected (* = marked no-connect by the designer): U1 A1(PE4)* A2(PE3)* A3(PE2)* A11(PD7)* B1(PE5)* B2(PE6)* B3(PG13)* B5(PB7)* B6(PB6)* B7(PG15)* B8(PG11)* B9(PJ13)* B10(PJ12)* B11(PD6)* C4(PK7)* C5(PK6)* C6(PK5)* C7(PG12)* C8(PG10)* C9(PJ14)* C10(PD5)* C11(PD3)* D1(PC13)* D7(PK4)* D8(PK3)* D10(PJ15)* D12(PD2)* D13(PH15)* D15(PA10)* E1(PC14)* E3(PI12)* E15(PA9)* F1(PC15)* F12(PK1)* F13(PK2)* G2(PF2)* G3(PI13)* G4(PI15)* G12(PJ11)* G13(PK0)* G15(PC7)* H2(PF3)* H3(PI14)* H4(PH4)* H12(PJ8)* H13(PJ10)* H14(PG8)* H15(PC6)* J2(PF4)* J3(PH5)* J4(PH3)* J12(PJ7)* J13(PJ9)* J14(PG7)* J15(PG6)* K3(PF5)* K4(PH2)* K12(PJ6)* K13(PD15)* K15(PD10)* L12(PD14)* L14(PD9)* L15(PD8)* M5(PB2)* M6(PF12)* M7(PG1)* M8(PF15)* M9(PJ4)* M10(PD12)* M11(PD13)* M12(PG3)* M13(PG2)* M14(PJ5)* M15(PH12)* N3(PA0)* N4(PA4)* N6(PF13)* N7(PG0)* N8(PJ3)* N9(PE8)* N11(PG5)* N12(PG4)* N13(PH7)* N14(PH9)* N15(PH11)* P5(PC5)* P6(PF14)* P7(PJ2)* P8(PF11)* P11(PE14)* P13(PH6)* P14(PH8)* P15(PH10)* R6(PJ0)* R7(PJ1)* R8(PE7)* R11(PE15)* R12(PE13)* R13(PB11)*

### Notes on the sheet
- UART4 - RS-485 МС
  UART5 - RS-485 СОП
  UART7 - RS-485 СОП Резерв
  UART8 - НМ-3 UART
  USART1 - Dedug UART
  USART2 - RS-485 МС Резерв
  USART3 -  НМ-1 UART
  USART6 -  НМ-2 UART
- Подп. и дата
- Инв. № дубл.
- Взам. инв. №
- Инв. № подл.
- Изм.
- Лист
- № докум.
- Подп.
- Дата
- Форма 2а ГОСТ 2.104-2006
- Копировал
- Формат А3

### Library data of the parts
C3 C4 C7 C36-C39 C41 = Capacitor: Назначение: SMD-конденсатор; Наименование: Конденсатор; Потребление, Вт: 0; Place_v1: *; Place_v2: *
  C3 C4 C7 C36 C39 C41: Value: 0.1мкФ
  C37 C38: Value: 10мкФ
C34 C35 = Capacitor: as C33 on sheet nm_main; Диэлектрик: *; Place_v1: *; Place_v2: *
L4 L5 = Inductor: Наименование: Индуктивность; Назначение: SMD-индуктивность; Потребление, Вт: 0,010; Value: 1мкГн; Place_v1: *; Place_v2: *
R89-R91 = Resistor: as R88 on sheet nm_main; Place_v1: *; Place_v2: *
U1 = STM32F769NI: High-performance and DSP with FPU, Arm Cortex-M7 MCU with 2 Mbytes of Flash memory, 216 MHz CPU, Art Accelerator, L1 cache, SDRAM, TFT, MIPI-DSI, JPEG codec, DFSDM; Потребление, Вт: 0.01; Назначение: Arm Cortex-M7 MCU; ComponentLink1Description: DataSheet; ComponentLink1URL: https://www.st.com/resource/en/datasheet/stm32f769ni.pdf; Наименование: STM32F769NI

## Sheet nm_mem.SchDoc: =GlobalProjectName
size 209 x 297 mm; Organization: НГУ; DocumentNumber: ЮМПД.466229.001 Э3; Revision: v1.0; SheetNumber: 5; SheetTotal: 9; PageSetup: Record=PageOptions|CenterHorizontal=True|CenterVertical=True|PrintScale=1.00|XCorrection=1.00|YCorrection=1.00|PrintKind=1|BorderSize=5000000|LeftOffset=0|BottomOffset=0|Orientation=2|PaperLength=1000|PaperWidth=1000|Scale=100|PaperSource=15|PrintQuality=1200|MediaType=1|DitherType=10|PaperKind=A3|PrintScaleMode=1; Weight: -; ScaleFactor: -; FirstApplication: ЮМПД.466229.001
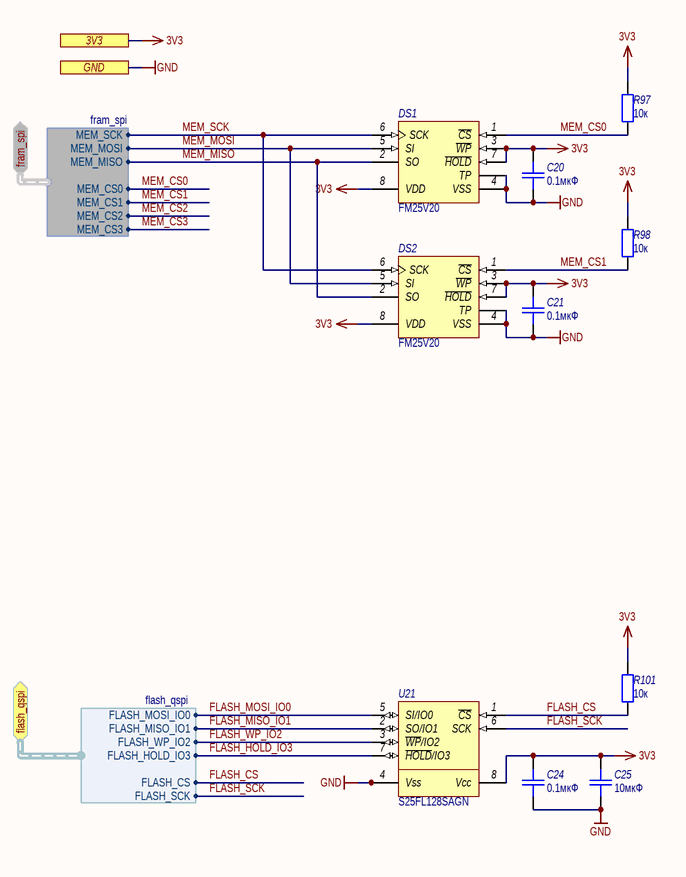
[diagram p2: nm_mem.SchDoc]

### Parts
C20  0.1мкФ  [SMD_C0603]
C21  0.1мкФ  [SMD_C0603]
C24  0.1мкФ  [SMD_C0603]
C25  10мкФ  [SMD_C0603]
DS1  FM25V20  [TDFN-8_6x5]
DS2  FM25V20  [TDFN-8_6x5]
R97  value 10к  [SMD_0603]  (hidden comment: Resistor)
R98  value 10к  [SMD_0603]  (hidden comment: Resistor)
R101  value 10к  [SMD_0603]  (hidden comment: Resistor)
U21  S25FL128SAGN  [WSON-8_6x8]

### Ports
3V3, flash_qspi (bidir, harness flash_qspi), fram_spi (bidir, harness fram_spi), GND

### Harnesses
fram_spi: MEM_SCK, MEM_MOSI, MEM_MISO, MEM_CS0, MEM_CS1, MEM_CS2, MEM_CS3
flash_qspi: FLASH_MOSI_IO0, FLASH_MISO_IO1, FLASH_WP_IO2, FLASH_HOLD_IO3, FLASH_CS, FLASH_SCK

### Nets
3V3: C20.2 C21.2 C24.2 C25.2 DS1.3(~{WP}) DS1.7(~{HOLD}) DS1.8(VDD) DS2.3(~{WP}) DS2.7(~{HOLD}) DS2.8(VDD) R97.1 R98.1 R101.1 U21.8(Vcc) ; port 3V3
GND: C20.1 C21.1 C24.1 C25.1 DS1.4(VSS) DS1.TP DS2.4(VSS) DS2.TP U21.4(Vss) U21.9(TP) ; port GND
FLASH_CS: R101.2 U21.1(~{CS}) ; port flash_qspi.FLASH_CS
FLASH_HOLD_IO3: U21.7(~{HOLD}/IO3) ; port flash_qspi.FLASH_HOLD_IO3
FLASH_MISO_IO1: U21.2(SO/IO1) ; port flash_qspi.FLASH_MISO_IO1
FLASH_MOSI_IO0: U21.5(SI/IO0) ; port flash_qspi.FLASH_MOSI_IO0
FLASH_SCK: U21.6(SCK) ; port flash_qspi.FLASH_SCK
FLASH_WP_IO2: U21.3(~{WP}/IO2) ; port flash_qspi.FLASH_WP_IO2
MEM_CS0: DS1.1(~{CS}) R97.2 ; port fram_spi.MEM_CS0
MEM_CS1: DS2.1(~{CS}) R98.2 ; port fram_spi.MEM_CS1
MEM_MISO: DS1.2(SO) DS2.2(SO) ; port fram_spi.MEM_MISO
MEM_MOSI: DS1.5(SI) DS2.5(SI) ; port fram_spi.MEM_MOSI
MEM_SCK: DS1.6(SCK) DS2.6(SCK) ; port fram_spi.MEM_SCK

### Notes on the sheet
- Подп. и дата
- Инв. № дубл.
- Взам. инв. №
- Инв. № подл.
- Изм.
- Лист
- № докум.
- Подп.
- Дата
- Форма 2а ГОСТ 2.104-2006
- Копировал
- Формат А4

### Library data of the parts
C20 C21 C24 C25 = Capacitor: as C3 on sheet nm_mcu; Place_v1: *; Place_v2: *
  C20 C21 C24: Value: 0.1мкФ
  C25: Value: 10мкФ
DS1 DS2 = FM25V: 2Mb Serial 3V FRAM Memory; Потребление, Вт: 0,009; Назначение: 2Mb Serial 3V FRAM Memory; ComponentLink1Description: Datasheet; ComponentLink1URL: https://www.cypress.com/file/136456/download; Наименование: FM25V20; Place_v1: *; Place_v2: *
R97 R98 R101 = Resistor: as R88 on sheet nm_main; Place_v1: *; Place_v2: *
U21 = S25FL128SAGN: Programmable NOR flash memory; Потребление, Вт: 0.1; Назначение: Programmable NOR flash memory; ComponentLink1Description: DataSheet; ComponentLink1URL: https://www.infinite-electronic.ru/datasheet/8b-S25FL256SAGBHV203.pdf; Supplier 1: Digi-Key; Supplier Part Number 1: 428-4618-ND; Наименование: S25FL128SAGN; Place_v1: *; Place_v2: *

## Sheet nm_npu_proc.SchDoc
size 209 x 297 mm; SheetNumber: 8; SheetTotal: 9
Used 3 times, as channels nm_3, nm_2, nm_1. Parts and nets are listed once, with the designators drawn on the sheet.
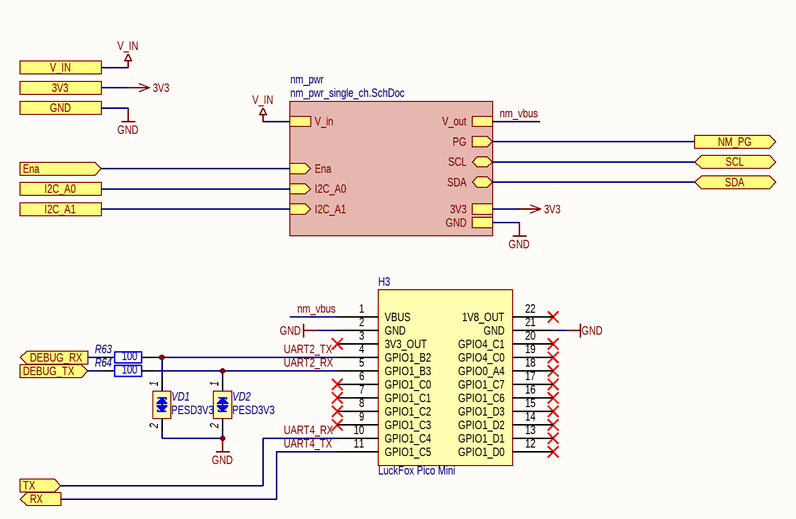
[diagram p3: nm_npu_proc.SchDoc]

### Parts
H3  LuckFox Pico Mini  [DS1021-1x20]
R63  value 100  [SMD_0603]  (hidden comment: Resistor)
R64  value 100  [SMD_0603]  (hidden comment: Resistor)
VD1  PESD3V3  [SOD-323]
VD2  PESD3V3  [SOD-323]

### Sub-sheets
nm_pwr = nm_pwr_single_ch.SchDoc (file not in this document): Ena (in), V_in, PG (out), GND, SCL (bidir), SDA (bidir), I2C_A0 (in), I2C_A1 (in), 3V3, V_out  | TP_STR: 5V0; R1_Value: 160k; R2_Value: 30k; R_efuse1_mid: 120k; R_efuse1_bot: 43k; R_efuse1_ilim: 3k3; R_pwr_led: 4k7; R_efuse2_bot: 130k; R_efuse2_mid: 62k; R_efuse2_ilim: 3k3; R_efuse1_top: 470k; R_efuse2_top: 470k; C_efuse2_dVdT: 10нФ; C_efuse2_itimer: 2.4нФ

### Ports
3V3, DEBUG_RX (out), DEBUG_TX (in), Ena (in), GND, I2C_A0, I2C_A1, NM_PG (out), RX (out), SCL (bidir), SDA (bidir), TX (in), V_IN

### Nets
3V3: port 3V3, sheet nm_pwr/3V3
GND: H3.2(GND) H3.21(GND) VD1.2(cathode_2) VD2.2(cathode_2) ; port GND, sheet nm_pwr/GND
V_IN: port V_IN, sheet nm_pwr/V_in
DEBUG_RX: R63.1 ; port DEBUG_RX
DEBUG_TX: R64.1 ; port DEBUG_TX
Ena: port Ena, sheet nm_pwr/Ena
I2C_A0: port I2C_A0, sheet nm_pwr/I2C_A0
I2C_A1: port I2C_A1, sheet nm_pwr/I2C_A1
NM_PG: port NM_PG, sheet nm_pwr/PG
nm_vbus: H3.1(VBUS) ; sheet nm_pwr/V_out
SCL: port SCL, sheet nm_pwr/SCL
SDA: port SDA, sheet nm_pwr/SDA
UART2_RX: H3.5(GPIO1_B3) R64.2 VD2.1(cathode_1)
UART2_TX: H3.4(GPIO1_B2) R63.2 VD1.1(cathode_1)
UART4_RX: H3.10(GPIO1_C4) ; port TX
UART4_TX: H3.11(GPIO1_C5) ; port RX

Not connected (* = marked no-connect by the designer): H3 3(3V3_OUT)* 6(GPIO1_C0)* 7(GPIO1_C1)* 8(GPIO1_C2)* 9(GPIO1_C3)* 12(GPIO1_D0)* 13(GPIO1_D1)* 14(GPIO1_D2)* 15(GPIO1_D3)* 16(GPIO1_C6)* 17(GPIO1_C7)* 18(GPIO0_A4)* 19(GPIO4_C0)* 20(GPIO4_C1)* 22(1V8_OUT)*

### Channels
nm_3: designators end in _1; ports 3V3=3V3 DEBUG_RX=DEBUG_RX DEBUG_TX=DEBUG_TX Ena=nm_bus3.Ena GND=GND I2C_A0=SCL I2C_A1=GND NM_PG=PG RX=nm_bus3.RX SCL=SCL SDA=SDA TX=nm_bus3.TX V_IN=VBAT
nm_2: designators end in _2; ports 3V3=3V3 DEBUG_RX=DEBUG_RX DEBUG_TX=DEBUG_TX Ena=nm_bus2.Ena GND=GND I2C_A0=SDA I2C_A1=GND NM_PG=PG RX=nm_bus2.RX SCL=SCL SDA=SDA TX=nm_bus2.TX V_IN=VBAT
nm_1: designators end in _3; ports 3V3=3V3 DEBUG_RX=DEBUG_RX DEBUG_TX=DEBUG_TX Ena=nm_bus1.Ena GND=GND I2C_A0=3V3 I2C_A1=GND NM_PG=PG RX=nm_bus1.RX SCL=SCL SDA=SDA TX=nm_bus1.TX V_IN=VBAT

### Notes on the sheet
- Подп. и дата
- Инв. № дубл.
- Взам. инв. №
- Инв. № подл.
- Изм.
- Лист
- № докум.
- Подп.
- Дата
- Форма 2а ГОСТ 2.104-2006
- Копировал
- Формат А4

### Library data of the parts
H3 = DS1021-1x20
R63 R64 = Resistor: as R88 on sheet nm_main; Place_v1: *; Place_v2: *
VD1 VD2 = PESDxL1BA: Low capacitance bidirectional ESD protection diodes; Назначение: ESD защитные диоды; Потребление, Вт: 0.0; Наименование: PESDxL1BA; ComponentLink1Description: DataSheet; ComponentLink1URL: https://static.chipdip.ru/lib/635/DOC005635911.pdf

## Sheet nm_temp_sens.SchDoc
size 209 x 297 mm; SheetNumber: 9; SheetTotal: 9
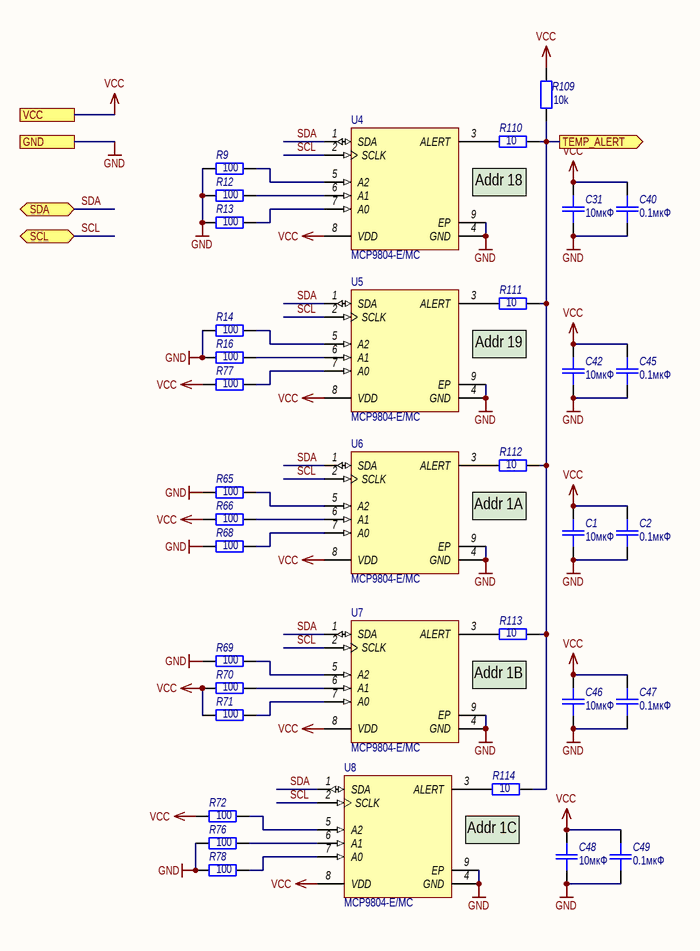
[diagram p4: nm_temp_sens.SchDoc]

### Parts
C1  10мкФ  [SMD_C0603]
C2  0.1мкФ  [SMD_C0603]
C31  10мкФ  [SMD_C0603]
C40  0.1мкФ  [SMD_C0603]
C42  10мкФ  [SMD_C0603]
C45  0.1мкФ  [SMD_C0603]
C46  10мкФ  [SMD_C0603]
C47  0.1мкФ  [SMD_C0603]
C48  10мкФ  [SMD_C0603]
C49  0.1мкФ  [SMD_C0603]
R9  100  [SMD_0603]
R12  100  [SMD_0603]
R13  100  [SMD_0603]
R14  100  [SMD_0603]
R16  100  [SMD_0603]
R65  100  [SMD_0603]
R66  100  [SMD_0603]
R68  100  [SMD_0603]
R69  100  [SMD_0603]
R70  100  [SMD_0603]
R71  100  [SMD_0603]
R72  100  [SMD_0603]
R76  100  [SMD_0603]
R77  100  [SMD_0603]
R78  100  [SMD_0603]
R109  10k  [SMD_0603]
R110  10  [SMD_0603]
R111  10  [SMD_0603]
R112  10  [SMD_0603]
R113  10  [SMD_0603]
R114  10  [SMD_0603]
U4  MCP9804-E/MC  [DFN-MC8]
U5  MCP9804-E/MC  [DFN-MC8]
U6  MCP9804-E/MC  [DFN-MC8]
U7  MCP9804-E/MC  [DFN-MC8]
U8  MCP9804-E/MC  [DFN-MC8]

### Ports
GND, SCL (bidir), SDA (bidir), TEMP_ALERT (out), VCC

### Nets
GND: C1.1 C2.1 C31.1 C40.1 C42.1 C45.1 C46.1 C47.1 C48.1 C49.1 R9.1 R12.1 R13.1 R14.1 R16.1 R65.1 R68.1 R69.1 R76.1 R78.1 U4.4(GND) U4.9(EP) U5.4(GND) U5.9(EP) U6.4(GND) U6.9(EP) U7.4(GND) U7.9(EP) U8.4(GND) U8.9(EP) ; port GND
VCC: C1.2 C2.2 C31.2 C40.2 C42.2 C45.2 C46.2 C47.2 C48.2 C49.2 R66.1 R70.1 R71.1 R72.1 R77.1 R109.2 U4.8(VDD) U5.8(VDD) U6.8(VDD) U7.8(VDD) U8.8(VDD) ; port VCC  [project net 5V]
SCL: U4.2(SCLK) U5.2(SCLK) U6.2(SCLK) U7.2(SCLK) U8.2(SCLK) ; port SCL
SDA: U4.1(SDA) U5.1(SDA) U6.1(SDA) U7.1(SDA) U8.1(SDA) ; port SDA
temp_alert: R109.1 R110.2 R111.2 R112.2 R113.2 R114.2 ; port TEMP_ALERT
NetR9_2: R9.2 U4.5(A2)
NetR12_2: R12.2 U4.6(A1)
NetR13_2: R13.2 U4.7(A0)
NetR14_2: R14.2 U5.5(A2)
NetR16_2: R16.2 U5.6(A1)
NetR65_2: R65.2 U6.5(A2)
NetR66_2: R66.2 U6.6(A1)
NetR68_2: R68.2 U6.7(A0)
NetR69_2: R69.2 U7.5(A2)
NetR70_2: R70.2 U7.6(A1)
NetR71_2: R71.2 U7.7(A0)
NetR72_2: R72.2 U8.5(A2)
NetR76_2: R76.2 U8.6(A1)
NetR77_2: R77.2 U5.7(A0)
NetR78_2: R78.2 U8.7(A0)
NetR110_1: R110.1 U4.3(ALERT)
NetR111_1: R111.1 U5.3(ALERT)
NetR112_1: R112.1 U6.3(ALERT)
NetR113_1: R113.1 U7.3(ALERT)
NetR114_1: R114.1 U8.3(ALERT)

### Notes on the sheet
- (near U4) Addr 18
- (near U5) Addr 19
- (near U6) Addr 1A
- (near U7) Addr 1B
- (near U8) Addr 1C
- Перв. примен.
- Справ. №
- Подп. и дата
- Инв. № дубл.
- Взам. инв. №
- Разраб.
- Изм.
- Лист
- № докум.
- Подп.
- Дата
- Литера
- Масса
- Масштаб
- Пров.
- Т.контр.
- Листов
- Инв. № подл.
- Н.контр.
- Утв.
- Форма 1 ГОСТ 2.104-2006
- Копировал
- Формат А4

### Library data of the parts
C1 C2 C31 C40 C42 C45-C49 = Capacitor: as C33 on sheet nm_main; Диэлектрик: *; Place_v1: *; Place_v2: *
  C1 C31 C42 C46 C48: Value: 10мкФ
  C2 C40 C45 C47 C49: Value: 0.1мкФ
R9 R12-R14 R16 R65 R66 R68-R72 R76-R78 R109-R114 = Resistor: as R4 on sheet nm_main; Place_v1: *; Place_v2: *
  R9 R12-R14 R16 R65 R66 R68-R72 R76-R78: Value: 100
  R109: Value: 10k
  R110-R114: Value: 10
U4-U8 = CMP-0192-00111-1: ±0.25°C Typ. Accuracy Digital Temperature Sensor, 8-Pin DFN, Extended Temperature; PackageVersion: revBB, Aug-2009; PackageDescription: 8-Lead Plastic Dual Flat, No Lead Package (MC) - 2x3x0.9mm Body [DFN]; DatasheetVersion: revA, Sep-2009; PackageReference: DFN-MC8

## Nets that join several sheets
3V3: nm_main (27 pins), nm_mcu (28 pins), nm_mem (14 pins)
GND: nm_main (63 pins), nm_mcu (30 pins), nm_mem (10 pins), nm_3 (H3_1.2 H3_1.21 VD1_1.2 VD2_1.2), nm_2 (H3_2.2 H3_2.21 VD1_2.2 VD2_2.2), nm_1 (H3_3.2 H3_3.21 VD1_3.2 VD2_3.2), nm_temp_sens (30 pins)
bat_low: nm_main (TP8.0 U10.7), nm_mcu (U1.E2)
DEBUG_RX: nm_main (P3.2), nm_1 (R63_3.1)
DEBUG_RX: nm_main (P4.2), nm_2 (R63_2.1)
DEBUG_RX: nm_main (P5.2), nm_3 (R63_1.1)
DEBUG_TX: nm_main (P3.1), nm_1 (R64_3.1)
DEBUG_TX: nm_main (P4.1), nm_2 (R64_2.1)
DEBUG_TX: nm_main (P5.1), nm_3 (R64_1.1)
FLASH_CS: nm_mcu (U1.P12), nm_mem (R101.2 U21.1)
FLASH_HOLD_IO3: nm_mcu (U1.N2), nm_mem (U21.7)
FLASH_MISO_IO1: nm_mcu (U1.L2), nm_mem (U21.2)
FLASH_MOSI_IO0: nm_mcu (U1.N10), nm_mem (U21.5)
FLASH_SCK: nm_mcu (U1.L1), nm_mem (U21.6)
FLASH_WP_IO2: nm_mcu (U1.K1), nm_mem (U21.3)
LED_CONNECTION: nm_main (R1.1), nm_mcu (U1.R4)
LED_MCU_STATE: nm_main (R2.1), nm_mcu (U1.R5)
MEM_CS0: nm_mcu (U1.P9), nm_mem (DS1.1 R97.2)
MEM_CS1: nm_mcu (U1.R9), nm_mem (DS2.1 R98.2)
MEM_MISO: nm_mcu (U1.P3), nm_mem (DS1.2 DS2.2)
MEM_MOSI: nm_mcu (U1.R3), nm_mem (DS1.5 DS2.5)
MEM_SCK: nm_mcu (U1.P4), nm_mem (DS1.6 DS2.6)
nm_bus1.RX: nm_mcu (U1.B13), nm_1 (H3_3.11)
nm_bus1.TX: nm_mcu (U1.B14), nm_1 (H3_3.10)
nm_bus2.RX: nm_mcu (U1.D9), nm_2 (H3_2.11)
nm_bus2.TX: nm_mcu (U1.A4), nm_2 (H3_2.10)
nm_bus3.RX: nm_mcu (U1.A6), nm_3 (H3_1.11)
nm_bus3.TX: nm_mcu (U1.A5), nm_3 (H3_1.10)
NRST: nm_main (R88.2 X2.1), nm_mcu (U1.J1)
pps: nm_main (TP7.0 U9.7), nm_mcu (U1.D2)
Reserve_0: nm_main (R105.1), nm_mcu (U1.F14)
Reserve_1: nm_main (R106.1), nm_mcu (U1.F15)
rx_dbg: nm_main (R95.1), nm_mcu (U1.R15)
SCL: nm_main (R4.1 TP4.0), nm_mcu (U1.A7), nm_temp_sens (5 pins)
SDA: nm_main (R5.1 TP5.0), nm_mcu (U1.B4), nm_temp_sens (5 pins)
SWCLK: nm_main (R94.2 X2.6), nm_mcu (U1.A14)
SWDIO: nm_main (R92.1 X2.2), nm_mcu (U1.A15)
SWO: nm_main (R93.1 X2.5), nm_mcu (U1.A10)
SYS_CLK: nm_main (R87.2), nm_mcu (U1.G1)
temp_alert: nm_mcu (U1.N5), nm_temp_sens (6 pins)
tx_dbg: nm_main (R96.1), nm_mcu (U1.R14)